# Altium schematic sheet Sheet2.SchDoc
size A4; SheetNumber: 1; SheetTotal: 2
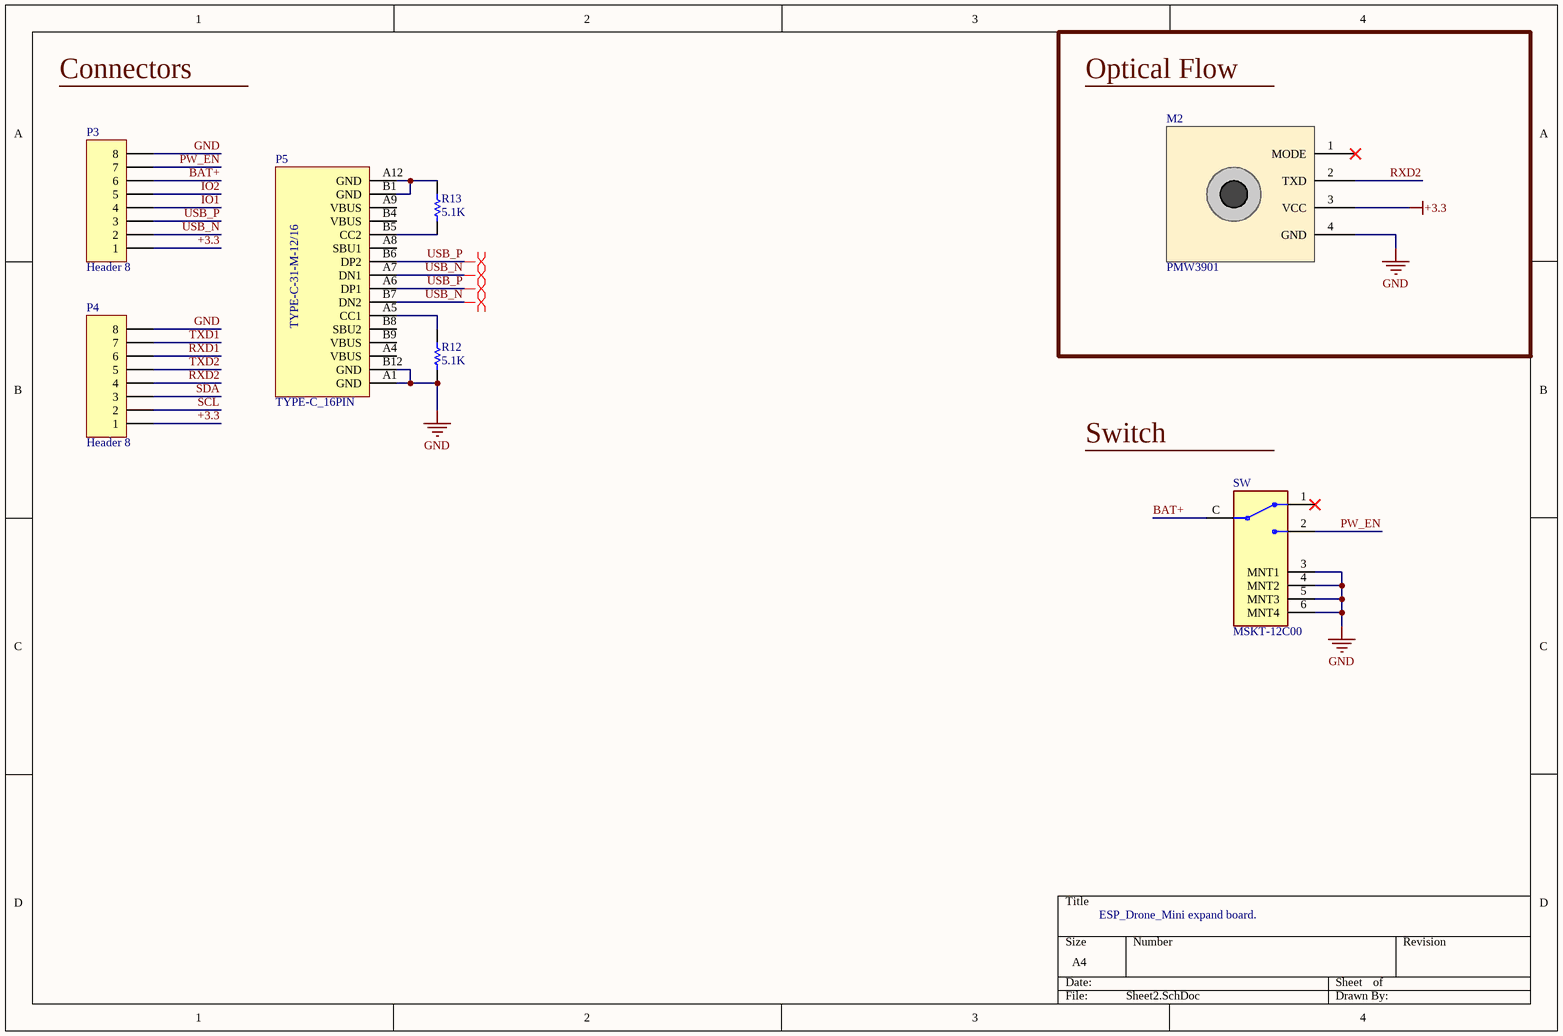
[diagram p0: Sheet2.SchDoc]

## Parts
M2  PMW3901
P3  Header 8  [HDR1X8]
P4  Header 8  [HDR1X8]
P5  TYPE-C_16PIN  [USB-TYPE-C_16PIN]
R12  5.1K  [RESC2013X60X40LL20T25_A]
R13  5.1K  [RESC2013X60X40LL20T25_A]
SW  MSKT-12C00  [MSKT-12C00]

## Blocks framed on the sheet
Optical Flow: M2

## Nets
+3.3: M2.3(VCC) P3.1 P4.1
GND: M2.4(GND) P3.8 P4.8 P5.A1(GND) P5.B12(GND) R12.1 SW.3(MNT1) SW.4(MNT2) SW.5(MNT3) SW.6(MNT4)
BAT+: P3.6 SW.C
IO1: P3.4
IO2: P3.5
PW_EN: P3.7 SW.2
RXD1: P4.6
RXD2: M2.2(TXD) P4.4
SCL: P4.2
SDA: P4.3
TXD1: P4.7
TXD2: P4.5
USB_N: P3.2 P5.A7(DN1) P5.B7(DN2)
USB_P: P3.3 P5.A6(DP1) P5.B6(DP2)
NetP5_A5: P5.A5(CC1) R12.2
NetP5_A12: P5.A12(GND) P5.B1(GND) R13.2
NetP5_B5: P5.B5(CC2) R13.1

Not connected (* = marked no-connect by the designer): M2 1(MODE)*; P5 A4(VBUS) A8(SBU1) A9(VBUS) B4(VBUS) B8(SBU2) B9(VBUS); SW 1*

## Layout directives
differential pair: USB_N, USB_P

## Notes on the sheet
- Connectors
- Switch
- ESP_Drone_Mini expand board.
- (in symbol TYPE-C_16PIN) TYPE-C-31-M-12/16

## Library data of the parts
P3 P4 = Header 8: Header, 8-Pin; LatestRevisionDate: 17-Jul-2002; LatestRevisionNote: Re-released for DXP Platform.; Publisher: Altium Limited
R12 R13 = CMP-2001-00582-2: Metal Film Chip Resistor, High Reliability Type, 0.125 W, +/- 0.1%, -55 to 155 degC, 0805 (2012 Metric), RoHS, Tape and Reel; Voltage Rating: 100V; Power Rating: 125mW(1/8W); Brand: Panasonic; Temperature Coefficient: 25PPM/C; Resistance: 10kOhms; Product Category: ThinFilmResistors-SMD; Datasheet Version: 02/2016; Operating Temperature Range: -55Cto+155C; Length: 2mm; Mounting Technology: SurfaceMount; Manufacturer URL: http://www.panasonic.com/; Width: 1.25mm; Packaging: Reel; Product: ThinFilmResistorsSMD; Package / Case: 0805(2012metric); Termination Style: SMD/SMT; Tolerance: 0.1%; Datasheet URL: https://industrial.panasonic.com/cdbs/www-data/pdf/RDM0000/AOA0000C307.pdf; Package Description: 2-Pin Surface Mount Device, Body 2 x 1.25 mm; Factory Pack Quantity: 5000; Series: ERA-6A; Case Code - mm: 2012; RoHS: Details; Package Reference: 0805; Height: 0.5mm; Manufacturer: Panasonic; Case Code - in: 0805; Type: MetalFilmChipResistors
P5 = TYPE-C_16PIN: LatestRevisionDate: 17-Jul-2002; LatestRevisionNote: Re-released for DXP Platform.; Publisher: Altium Limited